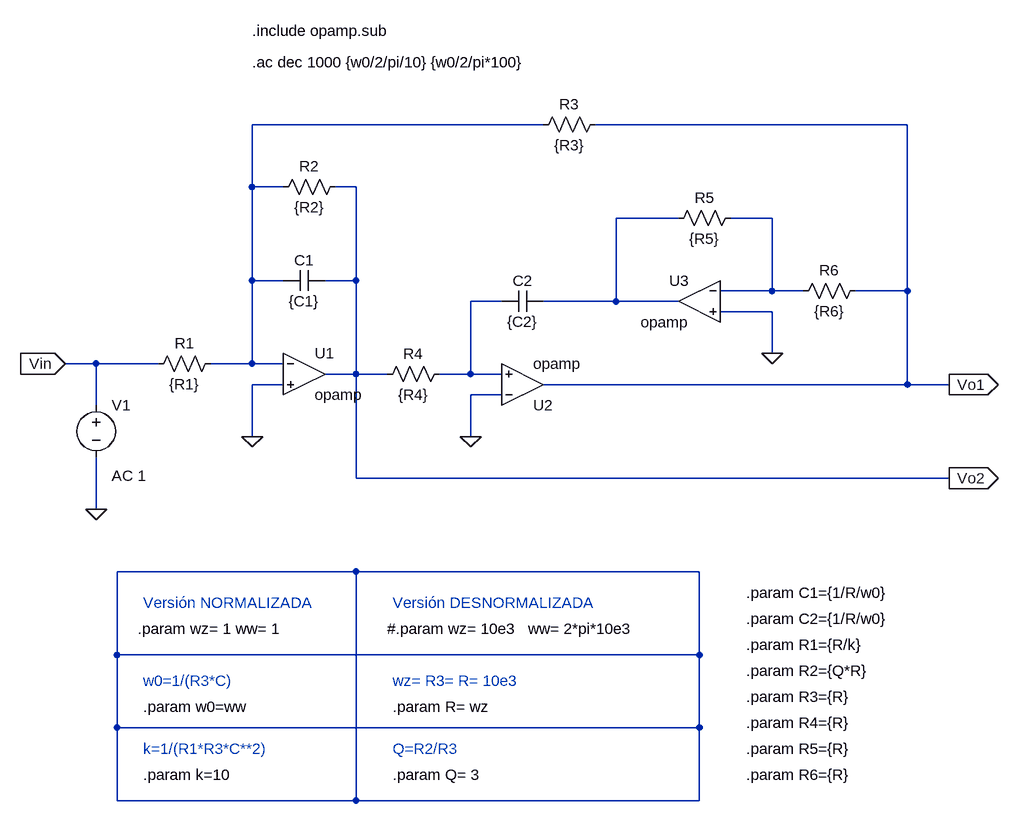
[diagram p0: schematic TS2_LTSpice.asc]
TS2_LTSpice.asc, the LTspice schematic file:
Version 4
SHEET 1 1836 888
WIRE 32 -256 -416 -256
WIRE 592 -256 112 -256
WIRE -416 -160 -416 -256
WIRE -368 -160 -416 -160
WIRE -256 -160 -288 -160
WIRE 240 -112 144 -112
WIRE 384 -112 320 -112
WIRE -416 -16 -416 -160
WIRE -368 -16 -416 -16
WIRE -256 -16 -256 -160
WIRE -256 -16 -304 -16
WIRE 384 0 384 -112
WIRE 384 0 304 0
WIRE 432 0 384 0
WIRE 592 0 592 -256
WIRE 592 0 512 0
WIRE -32 16 -80 16
WIRE 144 16 144 -112
WIRE 144 16 32 16
WIRE 240 16 144 16
WIRE 384 32 304 32
WIRE 384 96 384 32
WIRE -656 112 -704 112
WIRE -560 112 -656 112
WIRE -416 112 -416 -16
WIRE -416 112 -480 112
WIRE -368 112 -416 112
WIRE -256 128 -256 -16
WIRE -256 128 -304 128
WIRE -208 128 -256 128
WIRE -80 128 -80 16
WIRE -80 128 -128 128
WIRE -32 128 -80 128
WIRE -368 144 -416 144
WIRE 592 144 592 0
WIRE 592 144 32 144
WIRE 656 144 592 144
WIRE -32 160 -80 160
WIRE -656 176 -656 112
WIRE -416 224 -416 144
WIRE -80 224 -80 160
WIRE -256 288 -256 128
WIRE 656 288 -256 288
WIRE -656 336 -656 256
WIRE -256 432 -624 432
WIRE 272 432 -256 432
WIRE -624 560 -624 432
WIRE 272 560 272 432
WIRE 272 560 -624 560
WIRE -624 672 -624 560
WIRE 272 672 272 560
WIRE 272 672 -624 672
WIRE -624 784 -624 672
WIRE -256 784 -256 432
WIRE -256 784 -624 784
WIRE 272 784 272 672
WIRE 272 784 -256 784
FLAG -80 224 0
FLAG -416 224 0
FLAG -656 336 0
FLAG 384 96 0
FLAG -704 112 Vin
IOPIN -704 112 In
FLAG 656 144 Vo1
IOPIN 656 144 Out
FLAG 656 288 Vo2
IOPIN 656 288 Out
SYMBOL Opamps\\opamp -336 64 R0
SYMATTR InstName U1
SYMBOL Opamps\\opamp 0 208 M180
SYMATTR InstName U2
SYMBOL Opamps\\opamp 272 -48 M0
SYMATTR InstName U3
SYMBOL res -112 112 R90
WINDOW 0 0 56 VBottom 2
WINDOW 3 32 56 VTop 2
SYMATTR InstName R4
SYMATTR Value {R4}
SYMBOL res -464 96 R90
WINDOW 0 0 56 VBottom 2
WINDOW 3 32 56 VTop 2
SYMATTR InstName R1
SYMATTR Value {R1}
SYMBOL cap -304 -32 R90
WINDOW 0 0 32 VBottom 2
WINDOW 3 32 32 VTop 2
SYMATTR InstName C1
SYMATTR Value {C1}
SYMBOL res -272 -176 R90
WINDOW 0 0 56 VBottom 2
WINDOW 3 32 56 VTop 2
SYMATTR InstName R2
SYMATTR Value {R2}
SYMBOL cap 32 0 R90
WINDOW 0 0 32 VBottom 2
WINDOW 3 32 32 VTop 2
SYMATTR InstName C2
SYMATTR Value {C2}
SYMBOL res 336 -128 R90
WINDOW 0 0 56 VBottom 2
WINDOW 3 32 56 VTop 2
SYMATTR InstName R5
SYMATTR Value {R5}
SYMBOL res 528 -16 R90
WINDOW 0 0 56 VBottom 2
WINDOW 3 32 56 VTop 2
SYMATTR InstName R6
SYMATTR Value {R6}
SYMBOL res 128 -272 R90
WINDOW 0 0 56 VBottom 2
WINDOW 3 32 56 VTop 2
SYMATTR InstName R3
SYMATTR Value {R3}
SYMBOL voltage -656 160 R0
WINDOW 123 24 124 Left 2
WINDOW 39 0 0 Left 0
SYMATTR Value2 AC 1
SYMATTR InstName V1
SYMATTR Value ""
TEXT -416 -400 Left 2 !.include opamp.sub
TEXT -416 -352 Left 2 !.ac dec 1000 {w0/2/pi/10} {w0/2/pi*100}
TEXT -584 480 Left 2 ;Versión NORMALIZADA
TEXT -592 520 Left 2 !.param wz= 1 ww= 1
TEXT -200 480 Left 2 ;Versión DESNORMALIZADA
TEXT -208 520 Left 2 !#.param wz= 10e3   ww= 2*pi*10e3
TEXT 344 464 Left 2 !.param C1={1/R/w0}
TEXT -584 600 Left 2 ;w0=1/(R3*C)
TEXT -584 640 Left 2 !.param w0=ww
TEXT -584 704 Left 2 ;k=1/(R1*R3*C**2)
TEXT -200 704 Left 2 ;Q=R2/R3
TEXT -584 744 Left 2 !.param k=10
TEXT -200 744 Left 2 !.param Q= 3
TEXT -200 600 Left 2 ;wz= R3= R= 10e3
TEXT -200 640 Left 2 !.param R= wz
TEXT 344 504 Left 2 !.param C2={1/R/w0}
TEXT 344 544 Left 2 !.param R1={R/k}
TEXT 344 584 Left 2 !.param R2={Q*R}
TEXT 344 624 Left 2 !.param R3={R}
TEXT 344 664 Left 2 !.param R4={R}
TEXT 344 704 Left 2 !.param R5={R}
TEXT 344 744 Left 2 !.param R6={R}

The netlist it stands for:
* TS2_LTSpice.asc
XU1 N001 0 Vo2 opamp Aol=100K GBW=10Meg  ; pins invin noninvin out
XU2 0 N004 Vo1 opamp Aol=100K GBW=10Meg  ; pins invin noninvin out
XU3 N003 0 N002 opamp Aol=100K GBW=10Meg  ; pins invin noninvin out
R4 N004 Vo2 {R4}
R1 N001 Vin {R1}
C1 Vo2 N001 {C1}
R2 Vo2 N001 {R2}
C2 N002 N004 {C2}
R5 N003 N002 {R5}
R6 Vo1 N003 {R6}
R3 Vo1 N001 {R3}
V1 Vin 0 AC 1
.include opamp.sub
.ac dec 1000 {w0/2/pi/10} {w0/2/pi*100}
* Versión NORMALIZADA
.param wz= 1 ww= 1
* Versión DESNORMALIZADA
#.param wz= 10e3   ww= 2*pi*10e3
.param C1={1/R/w0}
* w0=1/(R3*C)
.param w0=ww
* k=1/(R1*R3*C**2)
* Q=R2/R3
.param k=10
.param Q= 3
* wz= R3= R= 10e3
.param R= wz
.param C2={1/R/w0}
.param R1={R/k}
.param R2={Q*R}
.param R3={R}
.param R4={R}
.param R5={R}
.param R6={R}
.backanno
.end